# Altium schematic sheet BUGMain.SchDoc
size A4; Author: Koen van Remundt; Revision: v1.0; SheetNumber: 1; SheetTotal: 1
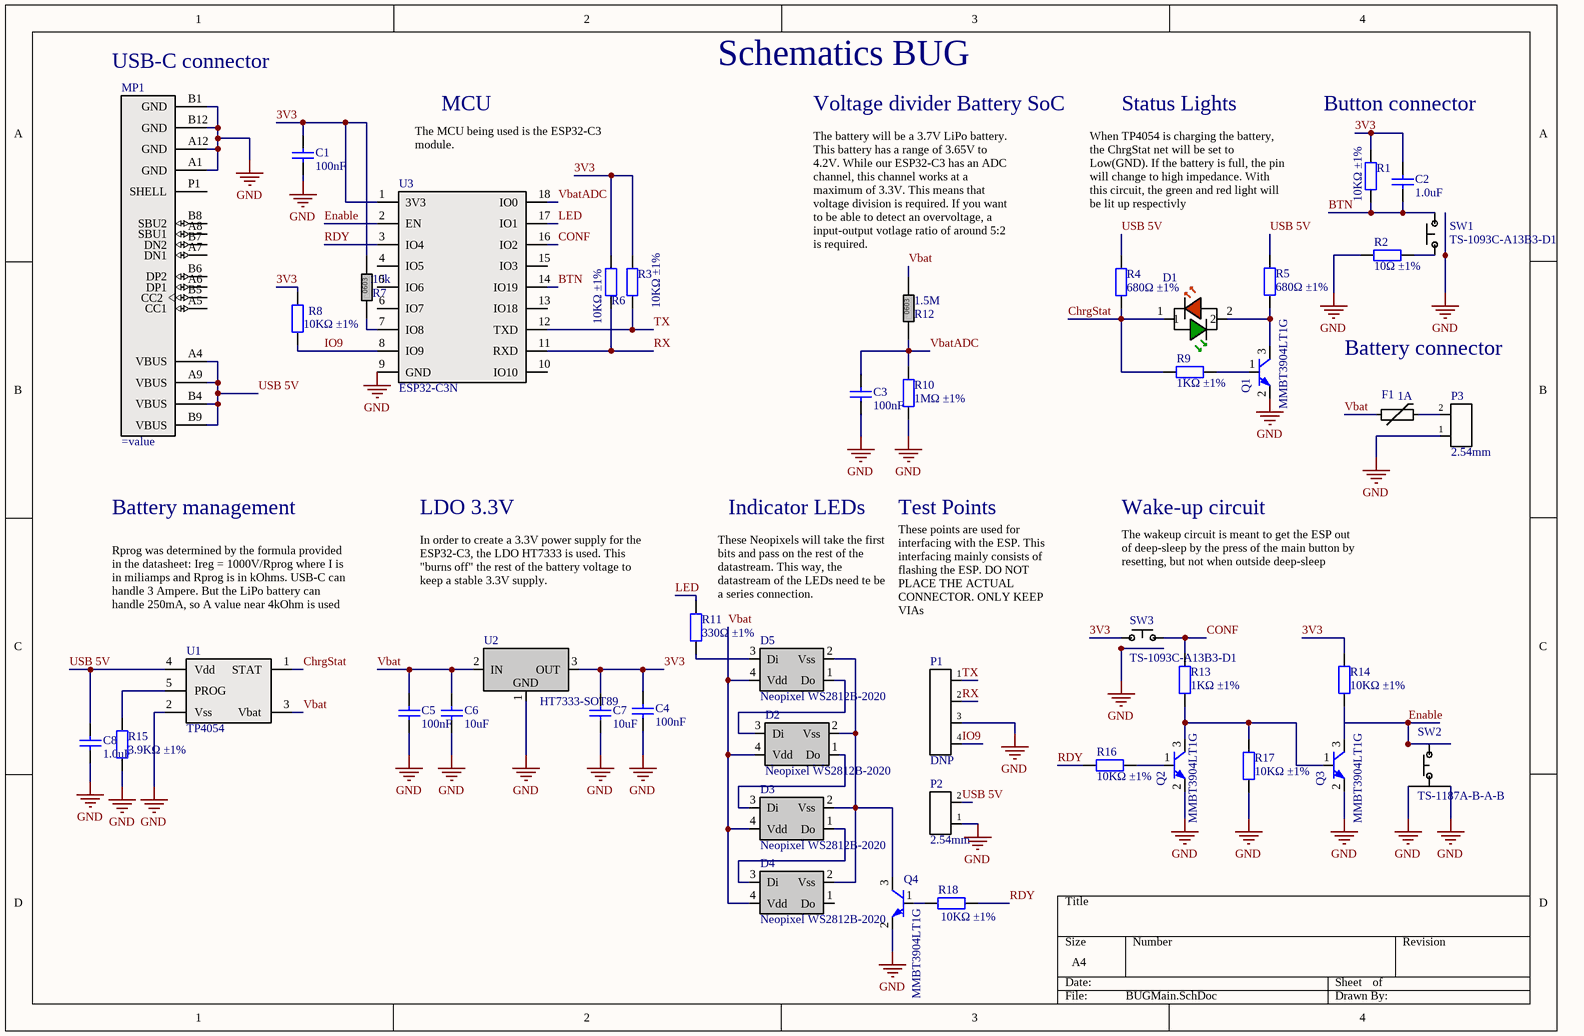
[diagram p0: BUGMain.SchDoc]

## Parts
C1  100nF  [0402_C]
C2  1.0uF  [0402_C]
C3  100nF  [0402_C]
C4  100nF  [0402_C]
C5  100nF  [0402_C]
C6  10uF  [0402_C]
C7  10uF  [0402_C]
C8  1.0uF  [0402_C]
D1  (no value)  [3mm round lamp]
D2  Neopixel WS2812B-2020  [WS2812B-2020]
D3  Neopixel WS2812B-2020  [WS2812B-2020]
D4  Neopixel WS2812B-2020  [WS2812B-2020]
D5  Neopixel WS2812B-2020  [WS2812B-2020]
F1  1A  [Cap 0805]
MP1  (no value)  [USBC 2169890001_sd]
P1  DNP  [Wurth 61900411121]
P2  2.54mm  [Wurth 61300211021]
P3  2.54mm  [Wurth 61300211021]
Q1  MMBT3904LT1G  [SOT-23-3-318-08_V]
Q2  MMBT3904LT1G  [SOT-23-3-318-08_V]
Q3  MMBT3904LT1G  [SOT-23-3-318-08_V]
Q4  MMBT3904LT1G  [SOT-23-3-318-08_V]
R1  10KΩ ±1%  [0402_R]
R2  10Ω ±1%  [0402_R]
R3  10KΩ ±1%  [0402_R]
R4  680Ω ±1%  [0402_R]
R5  680Ω ±1%  [0402_R]
R6  10KΩ ±1%  [0402_R]
R7  10k  [Res 0603]
R8  10KΩ ±1%  [0402_R]
R9  1KΩ ±1%  [0402_R]
R10  1MΩ ±1%  [0402_R]
R11  330Ω ±1%  [0402_R]
R12  1.5M  [Res 0603]
R13  1KΩ ±1%  [0402_R]
R14  10KΩ ±1%  [0402_R]
R15  3.9KΩ ±1%  [0402_R]
R16  10KΩ ±1%  [0402_R]
R17  10KΩ ±1%  [0402_R]
R18  10KΩ ±1%  [0402_R]
SW1  TS-1093C-A13B3-D1  [TS-1093C-A13B3-D1]
SW2  TS-1187A-B-A-B  [TS-1187A-B-A-B]
SW3  TS-1093C-A13B3-D1  [TS-1093C-A13B3-D1]
U1  TP4054  [SOT 23-5]
U2  HT7333-SOT89  [SOT89_L]
U3  ESP32-C3N  [ESP32-C3N]

## Nets
GND: C1.1 C3.1 C4.1 C5.1 C6.1 C7.1 C8.1 MP1.A1(GND) MP1.A12(GND) MP1.B1(GND) MP1.B12(GND) P1.3 P2.1 P3.1 Q1.2(E) Q2.2(E) Q3.2(E) Q4.2(E) R2.1 R10.1 R15.1 R17.1 SW1.2(Case) SW1.3(Case) SW2.C SW2.D SW3.2(Case) SW3.3(Case) U1.2(Vss) U2.1(GND) U3.9(GND)
3V3: C1.2 C2.2 C4.2 C7.2 R1.2 R3.2 R6.2 R7.2 R8.1 R14.2 SW3.0 U2.3(OUT) U3.1(3V3)
BTN: C2.1 R1.1 SW1.0 U3.14(IO19)
ChrgStat: D1.1 R4.1 R9.1 U1.1(STAT)
CONF: R13.2 SW3.1 U3.16(IO2)
Enable: Q3.3(C) R14.1 SW2.A SW2.B U3.2(EN)
IO9: P1.4 R8.2 U3.8(IO9)
LED: R11.2 U3.17(IO1)
RDY: R16.2 R18.2 U3.3(IO4)
RX: P1.2 R6.1 U3.11(RXD)
TX: P1.1 R3.1 U3.12(TXD)
USB 5V: C8.2 MP1.A4(VBUS) MP1.A9(VBUS) MP1.B4(VBUS) MP1.B9(VBUS) P2.2 R4.2 R5.2 U1.4(Vdd)
Vbat: C5.2 C6.2 D2.4(Vdd) D3.4(Vdd) D4.4(Vdd) D5.4(Vdd) F1.1 R12.2 U1.3(Vbat) U2.2(IN)
VbatADC: C3.2 R10.2 R12.1 U3.18(IO0)
NetD1_2: D1.2 Q1.3(C) R5.1
NetD2_1: D2.1(Do) D3.3(Di)
NetD2_2: D2.2(Vss) D3.2(Vss) D4.2(Vss) D5.2(Vss) Q4.3(C)
NetD2_3: D2.3(Di) D5.1(Do)
NetD3_1: D3.1(Do) D4.3(Di)
NetD5_3: D5.3(Di) R11.1
NetF1_2: F1.2 P3.2
NetQ1_1: Q1.1(B) R9.2
NetQ2_1: Q2.1(B) R16.1
NetQ2_3: Q2.3(C) Q3.1(B) R13.1 R17.2
NetQ4_1: Q4.1(B) R18.1
NetR2_2: R2.2 SW1.1
NetR7_1: R7.1 U3.7(IO8)
NetR15_2: R15.2 U1.5(PROG)

Not connected (* = marked no-connect by the designer): D4 1(Do); MP1 A5(CC1) A6(DP1) A7(DN1) A8(SBU1) B5(CC2) B6(DP2) B7(DN2) B8(SBU2) P1(SHELL); U3 4(IO5) 5(IO6) 6(IO7) 10(IO10) 13(IO18) 15(IO3)

## Notes on the sheet
- (near MP1) USB-C connector
- MCU
- Schematics BUG
- Voltage divider Battery SoC
- Status Lights
- Button connector
- (near U3) The MCU being used is the ESP32-C3 module.
- When TP4054 is charging the battery, the ChrgStat net will be set to Low(GND). If the battery is full, the pin will change to high impedance. With this circuit, the green and red light will be lit up respectivly
- (near R12) The battery will be a 3.7V LiPo battery. This battery has a range of 3.65V to 4.2V. While our ESP32-C3 has an ADC channel, this channel works at a maximum of 3.3V. This means that voltage division is required. If you want to be able to detect an overvoltage, a input-output votlage ratio of around 5:2 is required.
- Battery connector
- Battery management
- LDO 3.3V
- Indicator LEDs
- Test Points
- Wake-up circuit
- (near U1) Rprog was determined by the formula provided in the datasheet: Ireg = 1000V/Rprog where I is in miliamps and Rprog is in kOhms. USB-C can handle 3 Ampere. But the LiPo battery can handle 250mA, so A value near 4kOhm is used
- In order to create a 3.3V power supply for the ESP32-C3, the LDO HT7333 is used. This "burns off" the rest of the battery voltage to keep a stable 3.3V supply.
- These Neopixels will take the first bits and pass on the rest of the datastream. This way, the datastream of the LEDs need te be a series connection.
- These points are used for interfacing with the ESP. This interfacing mainly consists of flashing the ESP. DO NOT PLACE THE ACTUAL CONNECTOR. ONLY KEEP VIAs
- (near SW3) The wakeup circuit is meant to get the ESP out of deep-sleep by the press of the main button by resetting, but not when outside deep-sleep

## Library data of the parts
C1 C3-C5 = 0402 100nF (104) 10% 16V: Chip capacitors; Manufacturer: Samsung Electro-Mechanics; PartNumber: CL05B104KO5NNNC; Tolerance: 10%; Voltage: 16V; ComponentLink1Description: Supplier link; ComponentLink1URL: http://www.szlcsc.com/product/details_1877.html; Package: 0402; Supplier: LC; SuppliersPartNumber: C1525; Capacitance: 100nF
C2 C8 = 0402 1.0uF (105) 10% 25V: Chip capacitor; Manufacturer: Samsung Electro-Mechanics; PartNumber: CL05A105KA5NQNC; Capacitance: 1uF; Tolerance: 10%; Voltage: 25V; ComponentLink1Description: Supplier link; ComponentLink1URL: http://www.szlcsc.com/product/details_53938.html; Package: 0402; Supplier: LC; SuppliersPartNumber: C52923
C6 C7 = 0402 10uF (106) 20% 6.3V: Chip capacitors; Manufacturer: Samsung Electro-Mechanics; PartNumber: CL05A106MQ5NUNC; Tolerance: 20%; Voltage: 6.3V; ComponentLink1Description: Supplier link; ComponentLink1URL: http://www.szlcsc.com/product/details_16204.html; Package: 0402; Supplier: LC; SuppliersPartNumber: C15525; Capacitance: 10uF
D1 = MT2030-HRG-A: Dual LED inverted orange-green pins; Supplier: Mouser; Supplier Number: 193-MT2030-HRG-A; Created by: Koen van Remundt; Datasheet: https://nl.mouser.com/datasheet/2/1094/MT2030_HRG_A-2258170.pdf
F1 = PTC Fuse 1A: 6V, 0805; Created By: Koen van Remundt; Date Created: 14-10-2021; Value: 1A; Footprint: 0805; Specs: 6V; Supplier E.g.: JLCPCB; Supplier E.g. Number: C66452; Datasheet: https://datasheet.lcsc.com/lcsc/1808132010_TECHFUSE-SMD0805-050_C66452.pdf
MP1 = USBC 21269890001: Vertical USB2.0 C connector; Manufacturer number: 216989-0001; Supplier: Mouser; Supplier number: 538-216989-0001; Datasheet URL: https://www.molex.com/pdm_docs/sd/2169890001_sd.pdf
P1 = WR-WTB x4 2.54mm Straight: TH, 4Pos, 2.54mm Pitch, 0.08-0.33mm², 3A; Manufacturer: Wurth; Product Code: 61900411121; Supplier 1: Wurth; Supplier 1 Number: 61900411121; Created By: Koen van Remundt; Max Operating Temperature: 105°C; Date Created: 03-06-2019; Datasheet URL: https://katalog.we-online.com/em/datasheet/61900411121.pdf; Value: 2.54mm
P2 P3 = 2Header Male pin: TH, 2Pos, 2.54mm Pitch; Manufacturer: TE; Product Code: 640457-2; Supplier 1: JLCPCB; Supplier 1 Number: C86507; Created By: Koen van Remundt; Max Operating Temperature: 105°C; Date Created: 14-10-2021; Datasheet URL: https://datasheet.lcsc.com/lcsc/1811051111_TE-Connectivity-640457-2_C86507.pdf; Value: 2.54mm
R1 R3 R6 R8 R14 R16-R18 = 0402 10K (1002) 1%: Chip resistor; Manufacturer: Uniroyal Elec; PartNumber: 0402WGF1002TCE; Power: 1/16W; ComponentLink1Description: Supplier link; ComponentLink1URL: http://www.szlcsc.com/product/details_26487.html; Package: 0402; Supplier: LC; SuppliersPartNumber: C25744; Resistance: 10KΩ; Tolerance: 1%
R2 = 0402 10R (10R0) 1%: Chip resistor; Manufacturer: Uniroyal Elec; PartNumber: 0402WGF100JTCE; Power: 1/16W; ComponentLink1Description: Supplier link; ComponentLink1URL: http://www.szlcsc.com/product/details_25820.html; Package: 0402; Supplier: LC; SuppliersPartNumber: C25077; Resistance: 10Ω; Tolerance: 1%
R4 R5 = 0402 680R (6800) 1%: Chip resistor; Manufacturer: Uniroyal Elec; PartNumber: 0402WGF6800TCE; Power: 1/16W; ComponentLink1Description: Supplier link; ComponentLink1URL: http://www.szlcsc.com/product/details_25873.html; Package: 0402; Supplier: LC; SuppliersPartNumber: C25130; Resistance: 680Ω; Tolerance: 1%
R7 = Res 10k, 0603: 1%, >100mW; Specs: 1%, >50V, >100mW; Created By: Koen van Remundt; Date Created: 02-08-2021; Value: 10k; Footprint: 0603; Datasheet: https://datasheet.lcsc.com/lcsc/1811062009_UNI-ROYAL-Uniroyal-Elec-0603WAF1002T5E_C25804.pdf; Supplier: JLCPCB; Supplier Number: C25804
R9 R13 = 0402 1K (1001) 1%: Chip resistor; Manufacturer: Uniroyal Elec; PartNumber: 0402WGF1001TCE; Power: 1/16W; ComponentLink1Description: Supplier link; ComponentLink1URL: http://www.szlcsc.com/product/details_12256.html; Package: 0402; Supplier: LC; SuppliersPartNumber: C11702; Resistance: 1KΩ; Tolerance: 1%
R10 = 0402 1M (1004) 1%: Chip resistor; Manufacturer: Uniroyal Elec; PartNumber: 0402WGF1004TCE; Power: 1/16W; ComponentLink1Description: Supplier link; ComponentLink1URL: http://www.szlcsc.com/product/details_26826.html; Package: 0402; Supplier: LC; SuppliersPartNumber: C26083; Resistance: 1MΩ; Tolerance: 1%
R11 = 0402 330R (3300) 1%: Chip resistor; Manufacturer: Uniroyal Elec; PartNumber: 0402WGF3300TCE; Power: 1/16W; ComponentLink1Description: Supplier link; ComponentLink1URL: http://www.szlcsc.com/product/details_25847.html; Package: 0402; Supplier: LC; SuppliersPartNumber: C25104; Resistance: 330Ω; Tolerance: 1%
R12 = Res 1.5M, 0603: 1%, >100mW; Created By: Koen van Remundt; Date Created: 15-10-2021; Value: 1.5M; Footprint: 0603; Specs: 1%, >100mW; Datasheet: https://datasheet.lcsc.com/lcsc/1811081713_UNI-ROYAL-Uniroyal-Elec-0603WAF6800T5E_C23228.pdf; Supplier: JLCPCB; Supplier Number: C4172
R15 = 0402 3.9K (3901) 1%: Chip resistor; Manufacturer: Uniroyal Elec; PartNumber: 0402WGF3901TCE; Power: 1/16W; ComponentLink1Description: Supplier link; ComponentLink1URL: http://www.szlcsc.com/product/details_52734.html; Package: 0402; Supplier: LC; SuppliersPartNumber: C51721; Resistance: 3.9KΩ; Tolerance: 1%
U1 = TP4054: 3.7V Li-Po charger; Manufacturer: Microchip; Product Code: TP4054; Created By: Koen van Remundt; Max Operating Temperature: 85°C; Date Created: 05-10-2021; Datasheet URL: https://datasheet.lcsc.com/lcsc/1809261814_TOPPOWER-Nanjing-Extension-Microelectronics-TP4054_C32574.pdf; Value: TP4054; Supplier 1: JLCPCB; Supplier 1 number: C32574
U2 = CMP-0204-00157-1: Low Power Consumption LDO, Output Voltage 3.3V, SOT89 Pkg; DatasheetVersion: Rev1.4, Jan-2006; PackageVersion: May-2010; PackageReference: SOT89; Code_IPC: SOT89; PackageDescription: 3-Pin SOT-89 Package 1.5 mm Pitch, 4.1 mm Lead Span; Datasheet: https://datasheet.lcsc.com/lcsc/1811101813_Holtek-Semicon-HT7333-1_C77777.pdf
D2-D5 = Neopixel WS2812B-2020: Supplier: Mouser; Supplier Number: 485-4684; Datasheet: https://nl.mouser.com/datasheet/2/737/4684_WS2812B_2020_V1_3_EN-1900866.pdf
Q1-Q4 = MMBT3904LT1G: ComponentLink1Description: Datasheet; ComponentLink1URL: https://assets.nexperia.com/documents/data-sheet/MMBT3904.pdf
SW1 SW3 = TS-1093C-A13B3-D1: ComponentLink1Description: Datasheet; ComponentLink1URL: https://datasheet.lcsc.com/lcsc/2003171934_Yuandi-TS-1093C-A10B3-D1_C493053.pdf
SW2 = TS-1187A-B-A-B: ComponentLink1Description: Datasheet; ComponentLink1URL: https://datasheet.lcsc.com/lcsc/2002271431_XKB-Connectivity-TS-1187A-B-A-B_C318884.pdf